# EAGLE schematic led-matrix-headers-separate (EAGLE 9.1.0)
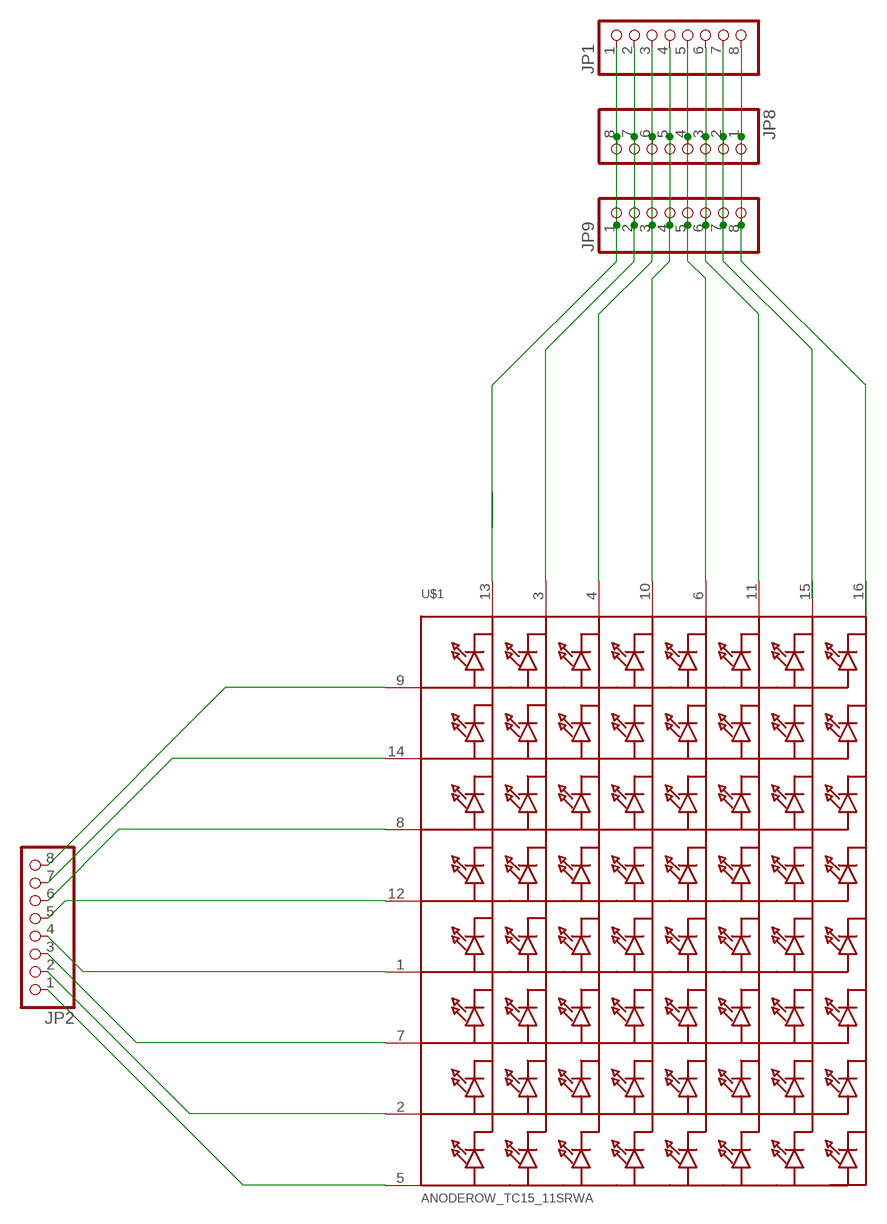
[diagram p0: schematic, sheet 1]

## Parts
JP1  PINHD-1X8/OCT  [1X08/OCT]
JP2  PINHD-1X8/OCT  [1X08/OCT]
JP8  PINHD-1X8/OCT  [1X08/OCT]
JP9  PINHD-1X8/OCT  [1X08/OCT]
U$1  ANODEROW_TC15_11SRWA  [SEGMENT_TC15-11SRWA]

## Nets
N$1: JP2.8 U$1.9(A1)
N$2: JP2.7 U$1.14(A2)
N$3: JP2.6 U$1.8(A3)
N$4: JP2.5 U$1.12(A4)
N$5: JP2.4 U$1.1(A5)
N$6: JP2.3 U$1.7(A6)
N$7: JP2.2 U$1.2(A7)
N$8: JP2.1 U$1.5(A8)
N$11: JP1.4 JP8.5 JP9.4 U$1.10(K4)
N$33: JP1.1 JP8.8 JP9.1 U$1.13(K1)
N$34: JP1.2 JP8.7 JP9.2 U$1.3(K2)
N$35: JP1.3 JP8.6 JP9.3 U$1.4(K3)
N$37: JP1.5 JP8.4 JP9.5 U$1.6(K5)
N$38: JP1.6 JP8.3 JP9.6 U$1.11(K6)
N$39: JP1.7 JP8.2 JP9.7 U$1.15(K7)
N$40: JP1.8 JP8.1 JP9.8 U$1.16(K8)

## Library data of the parts
JP1 JP2 JP8 JP9 = pinhead_v2:PINHD-1X8: PIN HEADER
U$1 = microbuilder:ANODEROW_TC15_11SRWA